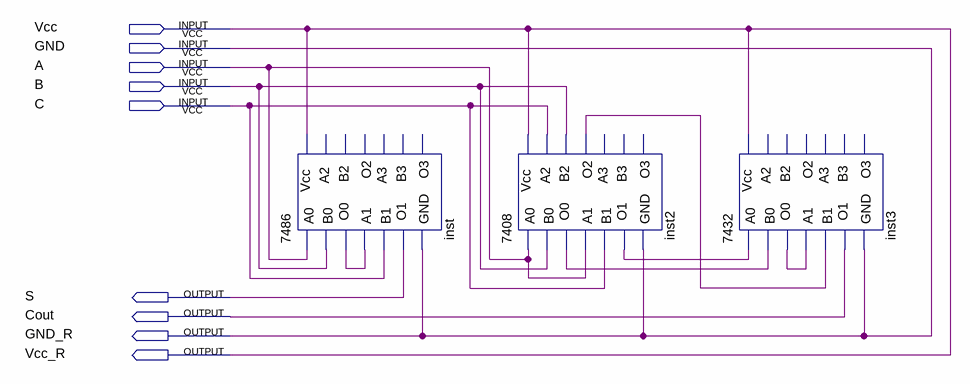
[diagram p0: schematic sheet]
// Quartus schematic Circuit_1.bdf as structural Verilog: 3 symbols, 9 pins
module Circuit_1 (
  input  Vcc,
  input  GND,
  input  A,
  input  B,
  input  C,
  output S,
  output Cout,
  output GND_R,
  output Vcc_R
);

  wire inst2_o0, inst2_o1, inst2_o2, inst3_o0, inst_o0;

  \7486  inst (
    .Vcc(Vcc), .A0(A), .B0(B), .A1(inst_o0), .B1(C), .GND(GND), .O0(inst_o0), .O1(S));  // open: A2, B2, A3, B3, O2, O3
  \7408  inst2 (
    .Vcc(Vcc), .A0(A), .B0(B), .A1(A), .B1(C), .A2(C), .B2(B), .GND(GND), .O0(inst2_o0), .O1(inst2_o1),
    .O2(inst2_o2));  // open: A3, B3, O3
  \7432  inst3 (
    .Vcc(Vcc), .A0(inst2_o1), .B0(inst2_o0), .A1(inst3_o0), .B1(inst2_o2), .GND(GND), .O0(inst3_o0), .O1(Cout));  // open: A2, B2, A3, B3, O2, O3

  assign GND_R = GND;
  assign Vcc_R = Vcc;
endmodule
